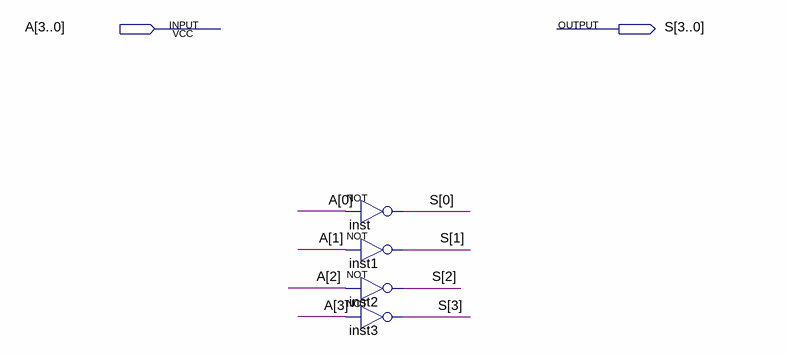
[diagram p0: schematic sheet]
// Quartus schematic NOTULA.bdf as structural Verilog: 4 symbols, 2 pins
module NOTULA (
  input  [3:0] A,
  output [3:0] S
);

  not inst (S[0], A[0]);
  not inst1 (S[1], A[1]);
  not inst2 (S[2], A[2]);
  not inst3 (S[3], A[3]);
endmodule
